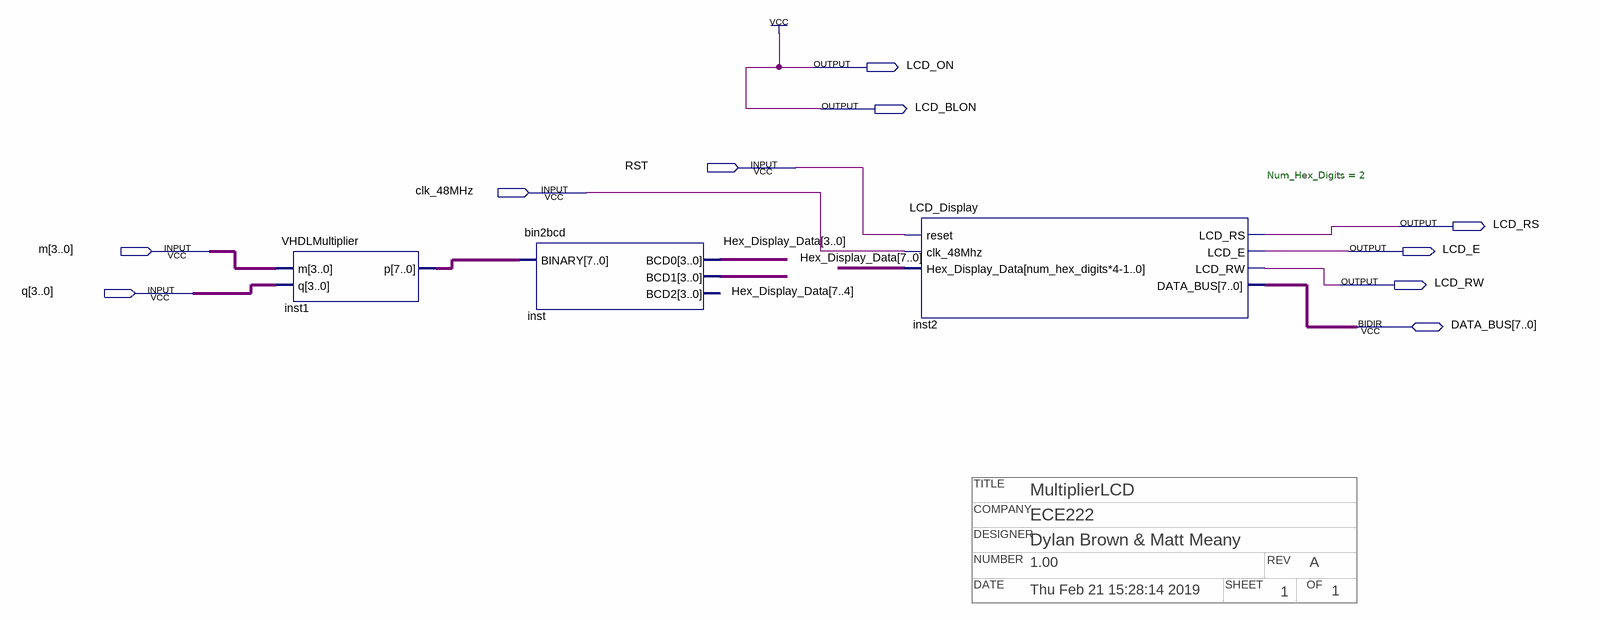
[diagram p0: schematic sheet]
// Quartus schematic MultiplierLCD.bdf as structural Verilog: 3 symbols, 10 pins
// Title block: COMPANY: ECE222; DATE: Thu Feb 21 15:28:14 2019; DESIGNER: Dylan Brown & Matt Meany; NUMBER: 1.00; OF: 1; REV: A; SHEET: 1; TITLE: MultiplierLCD
module MultiplierLCD (
  input  RST,
  input  clk_48MHz,
  input  [3:0] m,
  input  [3:0] q,
  inout  [7:0] DATA_BUS,
  output LCD_ON,
  output LCD_BLON,
  output LCD_RS,
  output LCD_E,
  output LCD_RW
);

  wire [7:0] Hex_Display_Data, inst1_p;

  VHDLMultiplier inst1 (.m(m), .q(q), .p(inst1_p));
  bin2bcd inst (.BINARY(inst1_p), .BCD0(Hex_Display_Data[3:0]), .BCD1(Hex_Display_Data[7:4]));  // open: BCD2
  LCD_Display #(.Num_Hex_Digits(2)) inst2 (
    .reset(RST), .clk_48Mhz(clk_48MHz), .Hex_Display_Data(Hex_Display_Data), .LCD_RS(LCD_RS), .LCD_E(LCD_E),
    .LCD_RW(LCD_RW), .DATA_BUS(DATA_BUS));

  assign LCD_BLON = 1'b1;
  assign LCD_ON = 1'b1;
endmodule
